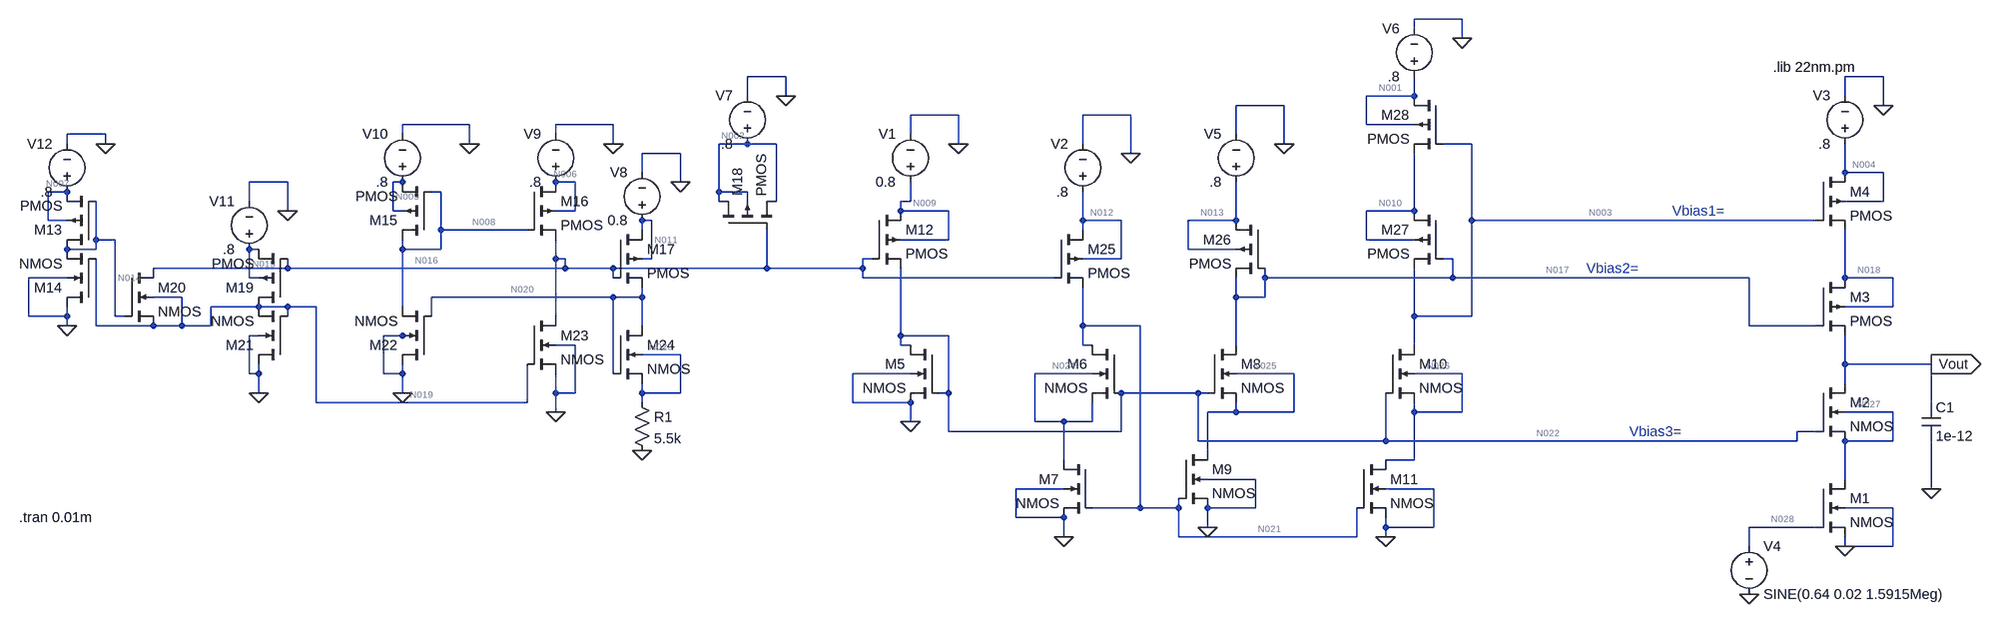
[diagram p0: schematic project_22nm.asc]
project_22nm.asc, the LTspice schematic file:
Version 4
SHEET 1 2340 708
WIRE 1024 -480 944 -480
WIRE 944 -464 944 -480
WIRE 1024 -448 1024 -480
WIRE -112 -384 -176 -384
WIRE 1872 -384 1808 -384
WIRE -176 -352 -176 -384
WIRE -112 -352 -112 -384
WIRE 944 -352 944 -384
WIRE 944 -352 864 -352
WIRE 1808 -352 1808 -384
WIRE 720 -336 640 -336
WIRE 1872 -336 1872 -384
WIRE 176 -320 96 -320
WIRE 464 -320 384 -320
WIRE -640 -304 -752 -304
WIRE -400 -304 -496 -304
WIRE 864 -304 864 -352
WIRE 944 -304 864 -304
WIRE -1248 -288 -1312 -288
WIRE -752 -288 -752 -304
WIRE -496 -288 -496 -304
WIRE 96 -288 96 -320
WIRE 640 -288 640 -336
WIRE -1312 -272 -1312 -288
WIRE -1248 -272 -1248 -288
WIRE -640 -272 -640 -304
WIRE -400 -272 -400 -304
WIRE -176 -272 -224 -272
WIRE -128 -272 -176 -272
WIRE 176 -272 176 -320
WIRE 384 -272 384 -320
WIRE 720 -272 720 -336
WIRE 1040 -272 992 -272
WIRE -288 -256 -352 -256
WIRE 464 -256 464 -320
WIRE -352 -224 -352 -256
WIRE 1808 -224 1808 -272
WIRE 1872 -224 1808 -224
WIRE -944 -208 -1008 -208
WIRE -752 -208 -768 -208
WIRE -464 -208 -496 -208
WIRE -288 -208 -288 -256
WIRE -1312 -192 -1344 -192
WIRE -688 -192 -704 -192
WIRE -224 -192 -224 -272
WIRE -176 -192 -224 -192
WIRE -1008 -176 -1008 -208
WIRE -224 -176 -224 -192
WIRE -176 -176 -176 -192
WIRE -128 -176 -128 -272
WIRE 96 -176 96 -208
WIRE 96 -176 80 -176
WIRE 1872 -176 1872 -224
WIRE 1872 -176 1808 -176
WIRE -944 -160 -944 -208
WIRE -768 -160 -768 -208
WIRE -752 -160 -768 -160
WIRE -464 -160 -464 -208
WIRE -464 -160 -496 -160
WIRE 80 -160 80 -176
WIRE 160 -160 80 -160
WIRE 944 -160 944 -256
WIRE 944 -160 864 -160
WIRE -1344 -144 -1344 -192
WIRE -1312 -144 -1344 -144
WIRE -336 -144 -352 -144
WIRE 384 -144 384 -192
WIRE 448 -144 384 -144
WIRE 640 -144 640 -208
WIRE 640 -144 560 -144
WIRE 1040 -144 1040 -272
WIRE 1760 -144 1040 -144
WIRE -688 -128 -688 -192
WIRE -544 -128 -688 -128
WIRE -352 -128 -352 -144
WIRE 384 -128 384 -144
WIRE -1264 -112 -1264 -176
WIRE -1232 -112 -1264 -112
WIRE 160 -112 160 -160
WIRE 160 -112 80 -112
WIRE 864 -112 864 -160
WIRE 944 -112 864 -112
WIRE -1264 -96 -1264 -112
WIRE -1264 -96 -1312 -96
WIRE -992 -96 -1008 -96
WIRE -752 -96 -752 -112
WIRE -688 -96 -688 -128
WIRE -688 -96 -752 -96
WIRE 560 -96 560 -144
WIRE 640 -96 560 -96
WIRE -496 -80 -496 -112
WIRE -480 -80 -496 -80
WIRE -336 -80 -336 -144
WIRE -336 -80 -352 -80
WIRE 32 -80 16 -80
WIRE 448 -80 448 -144
WIRE 448 -80 384 -80
WIRE 1008 -80 992 -80
WIRE -944 -64 -944 -80
WIRE -944 -64 -1168 -64
WIRE -480 -64 -480 -80
WIRE -480 -64 -944 -64
WIRE -400 -64 -480 -64
WIRE -144 -64 -144 -128
WIRE -144 -64 -400 -64
WIRE 16 -64 16 -80
WIRE 16 -64 -144 -64
WIRE -1312 -48 -1376 -48
WIRE -1008 -48 -1008 -96
WIRE -992 -48 -1008 -48
WIRE -400 -48 -400 -64
WIRE 16 -48 16 -64
WIRE 336 -48 16 -48
WIRE 688 -48 688 -64
WIRE 1008 -48 1008 -80
WIRE 1008 -48 688 -48
WIRE 1648 -48 1008 -48
WIRE 1808 -48 1808 -128
WIRE 1888 -48 1808 -48
WIRE -1120 -16 -1168 -16
WIRE -400 -16 -704 -16
WIRE -352 -16 -352 -32
WIRE -352 -16 -400 -16
WIRE 640 -16 640 -48
WIRE 688 -16 688 -48
WIRE 688 -16 640 -16
WIRE -992 0 -1072 0
WIRE -944 0 -992 0
WIRE -896 0 -944 0
WIRE -752 0 -752 -96
WIRE 1888 0 1888 -48
WIRE 1888 0 1808 0
WIRE -1376 16 -1376 -48
WIRE -1312 16 -1312 0
WIRE -1312 16 -1376 16
WIRE -1232 16 -1232 -112
WIRE -1216 16 -1232 16
WIRE -944 16 -944 0
WIRE -704 16 -704 -16
WIRE -496 16 -496 -80
WIRE 944 16 944 -64
WIRE 1040 16 1040 -144
WIRE 1040 16 944 16
WIRE -1312 32 -1312 16
WIRE -1264 32 -1264 -80
WIRE -1168 32 -1264 32
WIRE -1120 32 -1120 -16
WIRE -1120 32 -1168 32
WIRE -1072 32 -1072 0
WIRE -1072 32 -1120 32
WIRE -352 32 -352 -16
WIRE 384 32 384 -32
WIRE 480 32 384 32
WIRE 1648 32 1648 -48
WIRE 1760 32 1648 32
WIRE -992 48 -1008 48
WIRE -752 48 -784 48
WIRE -736 48 -752 48
WIRE 80 48 80 -64
WIRE 160 48 80 48
WIRE -464 64 -496 64
WIRE 80 64 80 48
WIRE 96 64 80 64
WIRE 384 64 384 32
WIRE 400 64 384 64
WIRE 640 64 640 -16
WIRE 944 64 944 16
WIRE -288 80 -352 80
WIRE 1808 96 1808 48
WIRE 1952 96 1808 96
WIRE -1008 112 -1008 48
WIRE -992 112 -992 96
WIRE -992 112 -1008 112
WIRE -784 112 -784 48
WIRE -752 112 -752 96
WIRE -752 112 -784 112
WIRE -400 112 -400 -16
WIRE 96 112 0 112
WIRE 400 112 304 112
WIRE 736 112 640 112
WIRE 1024 112 944 112
WIRE 1808 128 1808 96
WIRE -992 144 -992 112
WIRE -752 144 -752 112
WIRE -496 144 -496 112
WIRE -464 144 -464 64
WIRE -464 144 -496 144
WIRE -352 144 -352 128
WIRE -288 144 -288 80
WIRE -288 144 -352 144
WIRE 160 144 160 48
WIRE 160 144 144 144
WIRE 576 144 448 144
WIRE 592 144 576 144
WIRE -896 160 -896 0
WIRE -544 160 -544 96
WIRE -544 160 -896 160
WIRE -352 160 -352 144
WIRE 0 160 0 112
WIRE 96 160 0 160
WIRE 1952 160 1952 96
WIRE -496 176 -496 144
WIRE 640 176 640 160
WIRE 640 176 592 176
WIRE 736 176 736 112
WIRE 736 176 640 176
WIRE 944 176 944 160
WIRE 1024 176 1024 112
WIRE 1024 176 944 176
WIRE 1888 176 1808 176
WIRE 96 192 96 160
WIRE 304 192 304 112
WIRE 352 192 304 192
WIRE 400 192 400 160
WIRE 400 192 352 192
WIRE 160 208 160 144
WIRE 448 208 448 144
WIRE 448 208 160 208
WIRE 1760 208 1728 208
WIRE 576 224 576 144
WIRE 896 224 896 144
WIRE 896 224 576 224
WIRE 1728 224 1728 208
WIRE 1728 224 896 224
WIRE 1888 224 1888 176
WIRE 1888 224 1808 224
WIRE 592 240 592 176
WIRE 352 256 352 192
WIRE 944 256 944 176
WIRE 944 256 896 256
WIRE 672 288 592 288
WIRE 1808 288 1808 224
WIRE 352 304 272 304
WIRE 976 304 896 304
WIRE 1952 304 1952 224
WIRE 480 336 480 32
WIRE 480 336 400 336
WIRE 544 336 544 320
WIRE 544 336 480 336
WIRE 672 336 672 288
WIRE 672 336 592 336
WIRE 1888 336 1808 336
WIRE 272 352 272 304
WIRE 352 352 272 352
WIRE 592 368 592 336
WIRE 896 368 896 352
WIRE 976 368 976 304
WIRE 976 368 896 368
WIRE 1760 368 1648 368
WIRE 352 384 352 352
WIRE 544 384 544 336
WIRE 848 384 848 336
WIRE 848 384 544 384
WIRE 896 384 896 368
WIRE 1648 400 1648 368
WIRE 1808 400 1808 384
WIRE 1888 400 1888 336
WIRE 1888 400 1808 400
FLAG -1248 -272 0
FLAG -944 -160 0
FLAG -640 -272 0
FLAG -400 -272 0
FLAG -288 -208 0
FLAG -112 -352 0
FLAG -1312 32 0
FLAG -992 144 0
FLAG -752 144 0
FLAG -496 176 0
FLAG -352 240 0
FLAG 1952 304 0
FLAG 1808 400 0
FLAG 1648 480 0
FLAG 96 192 0
FLAG 176 -272 0
FLAG 464 -256 0
FLAG 720 -272 0
FLAG 1024 -448 0
FLAG 1872 -336 0
FLAG 352 384 0
FLAG 592 368 0
FLAG 896 384 0
FLAG 1952 96 Vout
IOPIN 1952 96 Out
DATAFLAG 1552 -48 ""
DATAFLAG 1680 -144 ""
DATAFLAG 1616 224 ""
DATAFLAG 1920 96 ""
SYMBOL pmos4 -544 -208 R0
SYMATTR InstName M16
SYMATTR Value2 l=22n w=264n
SYMBOL pmos4 -400 -128 R0
SYMATTR InstName M17
SYMATTR Value2 l=22n w=264n
SYMBOL pmos4 -224 -128 R270
SYMATTR InstName M18
SYMATTR Value2 l=22n w=22n
SYMBOL nmos4 -704 96 R180
SYMATTR InstName M22
SYMATTR Value2 l=22n w=110n
SYMBOL nmos4 -400 32 R0
SYMATTR InstName M24
SYMATTR Value2 l=22n w=330n
SYMBOL voltage -176 -256 R180
WINDOW 0 24 96 Left 2
WINDOW 3 24 16 Left 2
WINDOW 123 0 0 Left 0
WINDOW 39 0 0 Left 0
SYMATTR InstName V7
SYMATTR Value .8
SYMBOL voltage -352 -128 R180
WINDOW 0 24 96 Left 2
WINDOW 3 24 16 Left 2
WINDOW 123 0 0 Left 0
WINDOW 39 0 0 Left 0
SYMATTR InstName V8
SYMATTR Value 0.8
SYMBOL voltage -496 -192 R180
WINDOW 0 24 96 Left 2
WINDOW 3 24 16 Left 2
WINDOW 123 0 0 Left 0
WINDOW 39 0 0 Left 0
SYMATTR InstName V9
SYMATTR Value .8
SYMBOL voltage -752 -192 R180
WINDOW 0 24 96 Left 2
WINDOW 3 24 16 Left 2
WINDOW 123 0 0 Left 0
WINDOW 39 0 0 Left 0
SYMATTR InstName V10
SYMATTR Value .8
SYMBOL voltage -1008 -80 R180
WINDOW 0 24 96 Left 2
WINDOW 3 24 16 Left 2
WINDOW 123 0 0 Left 0
WINDOW 39 0 0 Left 0
SYMATTR InstName V11
SYMATTR Value .8
SYMBOL voltage -1312 -176 R180
WINDOW 0 24 96 Left 2
WINDOW 3 24 16 Left 2
WINDOW 123 0 0 Left 0
WINDOW 39 0 0 Left 0
SYMATTR InstName V12
SYMATTR Value .8
SYMBOL nmos4 -1264 0 R180
SYMATTR InstName M14
SYMATTR Value2 l=22n w=110n
SYMBOL nmos4 -1216 -64 R0
SYMATTR InstName M20
SYMATTR Value2 l=22n w=44n
SYMBOL nmos4 -944 96 R180
SYMATTR InstName M21
SYMATTR Value2 l=22n w=110n
SYMBOL nmos4 -544 16 R0
SYMATTR InstName M23
SYMATTR Value2 l=22n w=110n
SYMBOL res -368 144 R0
SYMATTR InstName R1
SYMATTR Value 5.5k
SYMBOL pmos4 -1264 -96 R180
SYMATTR InstName M13
SYMATTR Value2 l=22n w=11n
SYMBOL pmos4 -944 0 R180
SYMATTR InstName M19
SYMATTR Value2 l=22n w=264n
SYMBOL pmos4 -704 -112 R180
SYMATTR InstName M15
SYMATTR Value2 l=22n w=264n
SYMBOL nmos4 144 64 M0
SYMATTR InstName M5
SYMATTR Value2 l=22n w=55n
SYMBOL nmos4 448 64 M0
SYMATTR InstName M6
SYMATTR Value2 l=22n w=110n
SYMBOL nmos4 592 64 R0
SYMATTR InstName M8
SYMATTR Value2 l=22n w=110n
SYMBOL nmos4 896 64 R0
SYMATTR InstName M10
SYMATTR Value2 l=22n w=110n
SYMBOL pmos4 32 -160 R0
SYMATTR InstName M12
SYMATTR Value2 l=22n w=264n
SYMBOL pmos4 336 -128 R0
SYMATTR InstName M25
SYMATTR Value2 l=22n w=264n
SYMBOL pmos4 688 -144 M0
SYMATTR InstName M26
SYMATTR Value2 l=22n w=88n
SYMBOL pmos4 992 -160 M0
SYMATTR InstName M27
SYMATTR Value2 l=22n w=264n
SYMBOL pmos4 992 -352 M0
SYMATTR InstName M28
SYMATTR Value2 l=22n w=264n
SYMBOL voltage 96 -192 R180
WINDOW 0 24 96 Left 2
WINDOW 3 24 16 Left 2
WINDOW 123 0 0 Left 0
WINDOW 39 0 0 Left 0
SYMATTR InstName V1
SYMATTR Value 0.8
SYMBOL voltage 384 -176 R180
WINDOW 0 24 96 Left 2
WINDOW 3 24 16 Left 2
WINDOW 123 0 0 Left 0
WINDOW 39 0 0 Left 0
SYMATTR InstName V2
SYMATTR Value .8
SYMBOL voltage 640 -192 R180
WINDOW 0 24 96 Left 2
WINDOW 3 24 16 Left 2
WINDOW 123 0 0 Left 0
WINDOW 39 0 0 Left 0
SYMATTR InstName V5
SYMATTR Value .8
SYMBOL voltage 944 -368 R180
WINDOW 0 24 96 Left 2
WINDOW 3 24 16 Left 2
WINDOW 123 0 0 Left 0
WINDOW 39 0 0 Left 0
SYMATTR InstName V6
SYMATTR Value .8
SYMBOL nmos4 1760 128 R0
SYMATTR InstName M2
SYMATTR Value2 l=22e-9 w=157e-9
SYMBOL nmos4 1760 288 R0
SYMATTR InstName M1
SYMATTR Value2 l=22e-9 w=157e-9
SYMBOL pmos4 1760 -48 R0
SYMATTR InstName M3
SYMATTR Value2 l=22e-9 w=1100e-9
SYMBOL pmos4 1760 -224 R0
SYMATTR InstName M4
SYMATTR Value2 l=22e-9 w=1320e-9
SYMBOL voltage 1808 -256 R180
WINDOW 0 24 96 Left 2
WINDOW 3 24 16 Left 2
WINDOW 123 0 0 Left 0
WINDOW 39 0 0 Left 0
SYMATTR InstName V3
SYMATTR Value .8
SYMBOL cap 1936 160 R0
SYMATTR InstName C1
SYMATTR Value 1e-12
SYMBOL voltage 1648 384 R0
WINDOW 123 24 124 Left 2
WINDOW 39 0 0 Left 0
SYMATTR InstName V4
SYMATTR Value SINE(0.64 0.02 1.5915Meg)
SYMBOL nmos4 400 256 M0
SYMATTR InstName M7
SYMATTR Value2 l=22n w=110n
SYMBOL nmos4 544 240 R0
SYMATTR InstName M9
SYMATTR Value2 l=22n w=110n
SYMBOL nmos4 848 256 R0
SYMATTR InstName M11
SYMATTR Value2 l=22n w=110n
TEXT -1392 352 Left 2 !.tran 0.01m
TEXT 1688 -400 Left 2 !.lib 22nm.pm
TEXT 1520 -160 Left 2 ;Vbias1=
TEXT 1376 -64 Left 2 ;Vbias2=
TEXT 1448 208 Left 2 ;Vbias3=

The netlist it stands for:
* project_22nm.asc
M16 N006 N008 N016 N006 PMOS l=22n w=264n
M17 N011 N016 N020 N011 PMOS l=22n w=264n
M18 N002 N016 N002 N002 PMOS l=22n w=22n
M22 0 N020 N008 0 NMOS l=22n w=110n
M24 N020 N020 N023 N023 NMOS l=22n w=330n
V7 N002 0 .8
V8 N011 0 0.8
V9 N006 0 .8
V10 N005 0 .8
V11 N015 0 .8
V12 N007 0 .8
M14 0 N019 N014 0 NMOS l=22n w=110n
M20 N016 N014 N019 N019 NMOS l=22n w=44n
M21 0 N019 N019 0 NMOS l=22n w=110n
M23 N016 N019 0 0 NMOS l=22n w=110n
R1 N023 0 5.5k
M13 N014 N014 N007 N007 PMOS l=22n w=11n
M19 N019 N016 N015 N015 PMOS l=22n w=264n
M15 N008 N008 N005 N005 PMOS l=22n w=264n
M5 N022 N022 0 0 NMOS l=22n w=55n
M6 N021 N022 N024 N024 NMOS l=22n w=110n
M8 N017 N022 N025 N025 NMOS l=22n w=110n
M10 N003 N022 N026 N026 NMOS l=22n w=110n
M12 N009 N016 N022 N009 PMOS l=22n w=264n
M25 N012 N016 N021 N012 PMOS l=22n w=264n
M26 N013 N017 N017 N013 PMOS l=22n w=88n
M27 N010 N017 N003 N010 PMOS l=22n w=264n
M28 N001 N003 N010 N001 PMOS l=22n w=264n
V1 N009 0 0.8
V2 N012 0 .8
V5 N013 0 .8
V6 N001 0 .8
M2 Vout N022 N027 N027 NMOS l=22e-9 w=157e-9
M1 N027 N028 0 0 NMOS l=22e-9 w=157e-9
M3 N018 N017 Vout N018 PMOS l=22e-9 w=1100e-9
M4 N004 N003 N018 N004 PMOS l=22e-9 w=1320e-9
V3 N004 0 .8
C1 Vout 0 1e-12
V4 N028 0 SINE(0.64 0.02 1.5915Meg)
M7 N024 N021 0 0 NMOS l=22n w=110n
M9 N025 N021 0 0 NMOS l=22n w=110n
M11 N026 N021 0 0 NMOS l=22n w=110n
.model NMOS NMOS
.model PMOS PMOS
.lib standard.mos
.tran 0.01m
.lib 22nm.pm
* Vbias1=
* Vbias2=
* Vbias3=
.backanno
.end

* Results of the author's LTspice run, read from the files saved beside the schematic
* Operating Point, zero values left out:
*   V(n006) = 800 mV
*   V(n008) = 244.3 mV
*   V(n016) = 149.2 mV
*   V(n011) = 800 mV
*   V(n020) = 427.7 mV
*   V(n002) = 800 mV
*   V(n023) = 19.55 mV
*   V(n005) = 800 mV
*   V(n015) = 800 mV
*   V(n007) = 800 mV
*   V(n019) = 459 mV
*   V(n014) = 69.5 mV
*   V(n022) = 497.8 mV
*   V(n021) = 524.7 mV
*   V(n024) = 52.28 mV
*   V(n017) = 166.4 mV
*   V(n025) = 28.17 mV
*   V(n003) = 130.7 mV
*   V(n026) = 25.93 mV
*   V(n009) = 800 mV
*   V(n012) = 800 mV
*   V(n013) = 800 mV
*   V(n010) = 734.9 mV
*   V(n001) = 800 mV
*   V(vout) = 410.2 mV
*   V(n027) = 22.73 mV
*   V(n028) = 640 mV
*   V(n018) = 763.7 mV
*   V(n004) = 800 mV
*   Id(M16) = 1.421 µA
*   Is(M16) = -1.421 µA
*   Id(M17) = 3.554 µA
*   Ig(M17) = -5.01 pA
*   Is(M17) = -3.554 µA
*   Id(M13) = -1.049 µA
*   Is(M13) = 1.049 µA
*   Id(M19) = -3.248 µA
*   Ig(M19) = -4.989 pA
*   Is(M19) = 3.248 µA
*   Id(M15) = -1.021 µA
*   Is(M15) = 1.021 µA
*   Id(M12) = 2.896 µA
*   Ig(M12) = -4.963 pA
*   Is(M12) = -2.896 µA
*   Id(M25) = 2.669 µA
*   Ig(M25) = -4.946 pA
*   Is(M25) = -2.669 µA
*   Id(M26) = 1.682 µA
*   Is(M26) = -1.682 µA
*   Id(M27) = 1.571 µA
*   Is(M27) = -1.571 µA
*   Id(M28) = 1.571 µA
*   Ig(M28) = -7.795 pA
*   Is(M28) = -1.571 µA
*   Id(M3) = 5.226 µA
*   Ig(M3) = -3.617 pA
*   Is(M3) = -5.226 µA
*   Id(M4) = 5.226 µA
*   Ig(M4) = -40.46 pA
*   Is(M4) = -5.226 µA
*   Id(M22) = -1.021 µA
*   Is(M22) = 1.021 µA
*   Id(M24) = 3.554 µA
*   Is(M24) = -3.554 µA
*   Id(M14) = -1.049 µA
*   Is(M14) = 1.049 µA
*   Id(M20) = -1.606 nA
*   Ib(M20) = 1.587 nA
*   Is(M20) = 18.91 pA
*   Id(M21) = -3.246 µA
*   Is(M21) = 3.246 µA
*   Id(M23) = 1.423 µA
*   Is(M23) = -1.423 µA
*   Id(M5) = 2.896 µA
*   Is(M5) = -2.896 µA
*   Id(M6) = 2.669 µA
*   Is(M6) = -2.669 µA
*   Id(M8) = 1.682 µA
*   Is(M8) = -1.682 µA
*   Id(M10) = 1.571 µA
*   Is(M10) = -1.571 µA
*   Id(M2) = 5.226 µA
*   Ig(M2) = 1.307 pA
*   Is(M2) = -5.226 µA
*   Id(M1) = 5.226 µA
*   Ig(M1) = 41.05 pA
*   Is(M1) = -5.226 µA
*   Id(M7) = 2.669 µA
*   Ig(M7) = 4.086 pA
*   Is(M7) = -2.669 µA
*   Id(M9) = 1.682 µA
*   Ig(M9) = 4.106 pA
*   Is(M9) = -1.682 µA
*   Id(M11) = 1.571 µA
*   Ig(M11) = 4.109 pA
*   Is(M11) = -1.571 µA
*   I(R1) = 3.554 µA
*   I(V8) = -3.554 µA
*   I(V9) = -1.421 µA
*   I(V10) = -1.021 µA
*   I(V11) = -3.248 µA
*   I(V12) = -1.049 µA
*   I(V1) = -2.896 µA
*   I(V2) = -2.669 µA
*   I(V5) = -1.682 µA
*   I(V6) = -1.571 µA
*   I(V3) = -5.226 µA
*   I(V4) = -41.05 pA
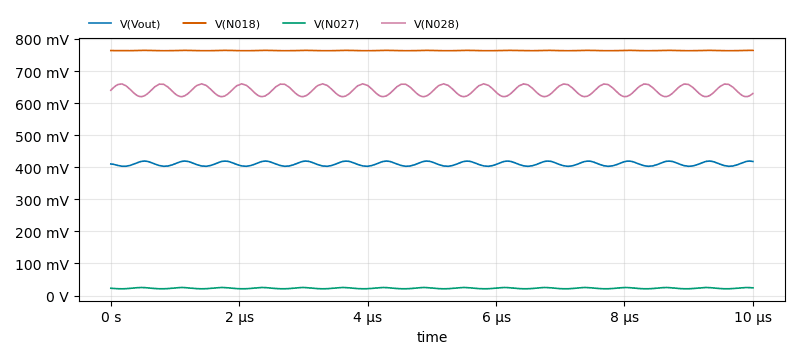
[diagram p1: Transient Analysis of project_22nm.asc, plotted from the saved traces]
* Transient Analysis, 1 run:
*   V(Vout): min 402.9 mV, max 419.2 mV, average 410.7 mV, rms 410.8 mV, last 418 mV
*   V(N018): min 763.2 mV, max 764.3 mV, average 763.7 mV, rms 763.7 mV, last 764.3 mV
*   V(N027): min 21 mV, max 24.93 mV, average 22.87 mV, rms 22.91 mV, last 23.95 mV
*   V(N028): min 620 mV, max 660 mV, average 639.9 mV, rms 640 mV, last 629.8 mV